# Altium schematic sheet EN-C200_RA0_NB-IoT.SchDoc
size A4
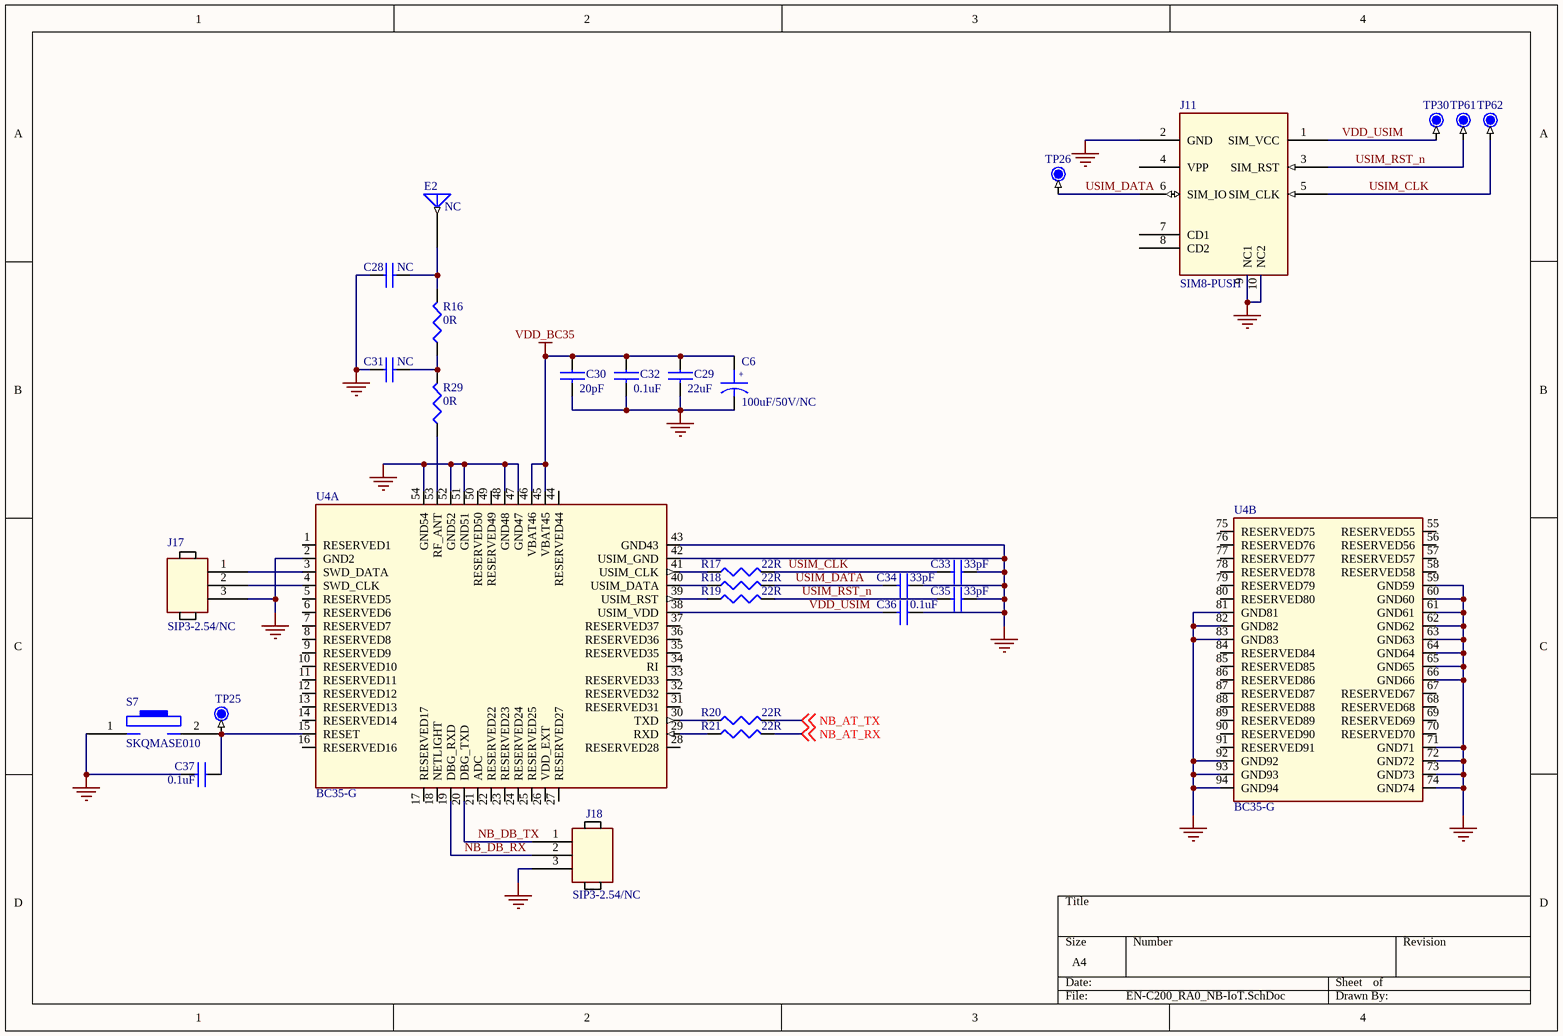
[diagram p0: EN-C200_RA0_NB-IoT.SchDoc]

## Parts
C6  100uF/50V/NC  [CAP_SMD_6_3MM]
C28  NC  [SC0603]
C29  22uF  [SC0805]
C30  20pF  [SC0603]
C31  NC  [SC0603]
C32  0.1uF  [SC0603]
C33  33pF  [SC0603]
C34  33pF  [SC0603]
C35  33pF  [SC0603]
C36  0.1uF  [SC0603]
C37  0.1uF  [SC0603]
E2  NC  [NB-ANT]
J11  SIM8-PUSH  [SIM8-50]
J17  SIP3-2.54/NC  [SIP-3P]
J18  SIP3-2.54/NC  [SIP-3P]
R16  0R  [SR0603]
R17  22R  [SR0603]
R18  22R  [SR0603]
R19  22R  [SR0603]
R20  22R  [SR0603]
R21  22R  [SR0603]
R29  0R  [SR0603]
S7  SKQMASE010  [SW2-240X140]
TP25  NC  [TP32-SMD]  (value not drawn)
TP26  NC  [TP32-SMD]  (value not drawn)
TP30  NC  [TP32-SMD]  (value not drawn)
TP61  NC  [TP32-SMD]  (value not drawn)
TP62  NC  [TP32-SMD]  (value not drawn)
U4  BC35-G  [BC35-G]  (parts A,B of 2)

## Nets
GND: C6.2 C28.1 C29.2 C30.2 C31.1 C32.2 C33.1 C34.1 C35.1 C36.1 C37.2 E2.2 E2.3 J11.2(GND) J11.9(NC1) J11.10(NC2) J17.3 J18.3 S7.1(A) U4.2(GND2) U4.42(USIM_GND) U4.43(GND43) U4.47(GND47) U4.48(GND48) U4.51(GND51) U4.52(GND52) U4.54(GND54) U4.59(GND59) U4.60(GND60) U4.61(GND61) U4.62(GND62) U4.63(GND63) U4.64(GND64) U4.65(GND65) U4.66(GND66) U4.71(GND71) U4.72(GND72) U4.73(GND73) U4.74(GND74) U4.81(GND81) U4.82(GND82) U4.83(GND83) U4.92(GND92) U4.93(GND93) U4.94(GND94)
VDD_BC35: C6.1 C29.1 C30.1 C32.1 U4.45(VBAT45) U4.46(VBAT46)
NB_AT_RX: R21.2 ; off-sheet NB_AT_RX
NB_AT_TX: R20.2 ; off-sheet NB_AT_TX
NB_DB_RX: J18.2 U4.19(DBG_RXD)
NB_DB_TX: J18.1 U4.20(DBG_TXD)
USIM_CLK: C33.2 J11.5(SIM_CLK) R17.2 TP62.1
USIM_DATA: C34.2 J11.6(SIM_IO) R18.2 TP26.1
USIM_RST_n: C35.2 J11.3(SIM_RST) R19.2 TP61.1
VDD_USIM: C36.2 J11.1(SIM_VCC) TP30.1 U4.38(USIM_VDD)
NetC28_2: C28.2 E2.1 R16.2
NetC31_2: C31.2 R16.1 R29.2
NetC37_1: C37.1 S7.2(B) TP25.1 U4.15(RESET)
NetJ17_1: J17.1 U4.3(SWD_DATA)
NetJ17_2: J17.2 U4.4(SWD_CLK)
NetR17_1: R17.1 U4.41(USIM_CLK)
NetR18_1: R18.1 U4.40(USIM_DATA)
NetR19_1: R19.1 U4.39(USIM_RST)
NetR20_1: R20.1 U4.30(TXD)
NetR21_1: R21.1 U4.29(RXD)
NetR29_1: R29.1 U4.53(RF_ANT)

Not connected (* = marked no-connect by the designer): J11 4(VPP) 7(CD1) 8(CD2); U4 1(RESERVED1) 5(RESERVED5) 6(RESERVED6) 7(RESERVED7) 8(RESERVED8) 9(RESERVED9) 10(RESERVED10) 11(RESERVED11) 12(RESERVED12) 13(RESERVED13) 14(RESERVED14) 16(RESERVED16) 17(RESERVED17) 18(NETLIGHT) 21(ADC) 22(RESERVED22) 23(RESERVED23) 24(RESERVED24) 25(RESERVED25) 26(VDD_EXT) 27(RESERVED27) 28(RESERVED28) 31(RESERVED31) 32(RESERVED32) 33(RESERVED33) 34(RI) 35(RESERVED35) 36(RESERVED36) 37(RESERVED37) 44(RESERVED44) 49(RESERVED49) 50(RESERVED50) 55(RESERVED55) 56(RESERVED56) 57(RESERVED57) 58(RESERVED58) 67(RESERVED67) 68(RESERVED68) 69(RESERVED69) 70(RESERVED70) 75(RESERVED75) 76(RESERVED76) 77(RESERVED77) 78(RESERVED78) 79(RESERVED79) 80(RESERVED80) 84(RESERVED84) 85(RESERVED85) 86(RESERVED86) 87(RESERVED87) 88(RESERVED88) 89(RESERVED89) 90(RESERVED90) 91(RESERVED91)

## Notes on the sheet
- (in symbol CAP POL) +

## Library data of the parts
C6 = CAP POL
C28-C37 = CAP NP
E2 = ANTENNA
J17 J18 = HEADER3
R16-R21 R29 = RESISTOR
S7 = PUSH-KEY
TP25 TP26 TP30 TP61 TP62 = TP
U4 = BC35-G: SPLIT_INST: TRUE; SWAP_INFO: (S1+S2)